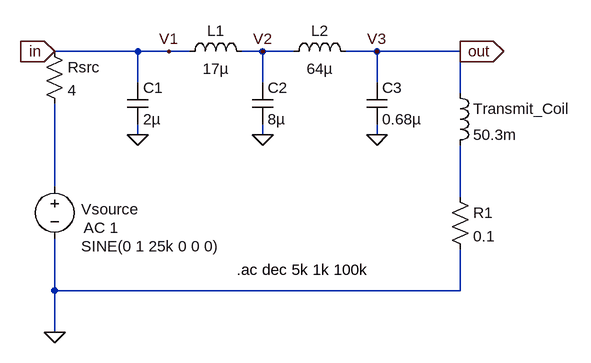
[diagram p0: schematic Bandpass_Excitation.asc]
Bandpass_Excitation.asc, the LTspice schematic file:
Version 4
SHEET 1 1748 1048
WIRE -736 -272 -864 -272
WIRE -688 -272 -736 -272
WIRE -656 -272 -688 -272
WIRE -544 -272 -576 -272
WIRE -496 -272 -544 -272
WIRE -368 -272 -416 -272
WIRE -240 -272 -368 -272
WIRE -736 -224 -736 -272
WIRE -544 -224 -544 -272
WIRE -368 -224 -368 -272
WIRE -240 -208 -240 -272
WIRE -736 -144 -736 -160
WIRE -544 -144 -544 -160
WIRE -368 -144 -368 -160
WIRE -864 -64 -864 -192
WIRE -240 -48 -240 -128
WIRE -864 96 -864 16
WIRE -240 96 -240 32
WIRE -240 96 -864 96
WIRE -864 160 -864 96
FLAG -864 160 0
FLAG -544 -144 0
FLAG -368 -144 0
FLAG -688 -272 V1
FLAG -544 -272 V2
FLAG -368 -272 V3
FLAG -736 -144 0
FLAG -864 -272 in
IOPIN -864 -272 In
FLAG -240 -272 out
IOPIN -240 -272 Out
SYMBOL voltage -864 -80 R0
WINDOW 123 45 79 Left 2
WINDOW 3 41 108 Left 2
WINDOW 0 41 51 Left 2
SYMATTR Value2 AC 1
SYMATTR SpiceLine Rser=0
SYMATTR Value SINE(0 1 25k 0 0 0)
SYMATTR InstName Vsource
SYMBOL ind -672 -256 R270
WINDOW 0 32 56 VTop 2
WINDOW 3 5 56 VBottom 2
SYMATTR InstName L1
SYMATTR Value 17µ
SYMATTR SpiceLine Rser=.2914
SYMBOL cap -560 -224 R0
SYMATTR InstName C2
SYMATTR Value 8µ
SYMATTR SpiceLine Rser=8.3m
SYMBOL ind -512 -256 R270
WINDOW 0 32 56 VTop 2
WINDOW 3 5 56 VBottom 2
SYMATTR InstName L2
SYMATTR Value 64µ
SYMATTR SpiceLine Rser=.415
SYMBOL cap -384 -224 R0
SYMATTR InstName C3
SYMATTR Value 0.68µ
SYMATTR SpiceLine Rser=1m
SYMBOL ind -256 -224 R0
SYMATTR InstName Transmit_Coil
SYMATTR Value 50.3m
SYMBOL res -880 -288 R0
SYMATTR InstName Rsrc
SYMATTR Value 4
SYMBOL res -256 -64 R0
SYMATTR InstName R1
SYMATTR Value 0.1
SYMBOL cap -752 -224 R0
SYMATTR InstName C1
SYMATTR Value 2µ
SYMATTR SpiceLine V=4 Irms=162m Rser=0.395426 Lser=0 mfg="KEMET" pn="C0402C103K7PAC" type="X5R"
TEXT -584 64 Left 2 !.ac dec 5k 1k 100k

The netlist it stands for:
* Bandpass_Excitation.asc
Vsource N001 0 SINE(0 1 25k 0 0 0) AC 1 Rser=0
L1 in V2 17µ Rser=.2914
C2 V2 0 8µ Rser=8.3m
L2 V2 out 64µ Rser=.415
C3 out 0 0.68µ Rser=1m
L§Transmit_Coil out N002 50.3m
Rsrc in N001 4
R1 N002 0 0.1
C1 in 0 2µ V=4 Irms=162m Rser=0.395426 Lser=0 mfg="KEMET" pn="C0402C103K7PAC" type="X5R"
.ac dec 5k 1k 100k
.backanno
.end